# EasyEDA schematic SCH_5Vcc_LM35_with_shortcircuit_protection_2024-01-12.json

## Sheets
1 template_circuit: TITLE: LM32 with 5Vcc and short-circuit protection; REV: 1.0; Date: 2024-01-09; Sheet: 1/1; Drawn By: Mortrack8; Company: Your Company
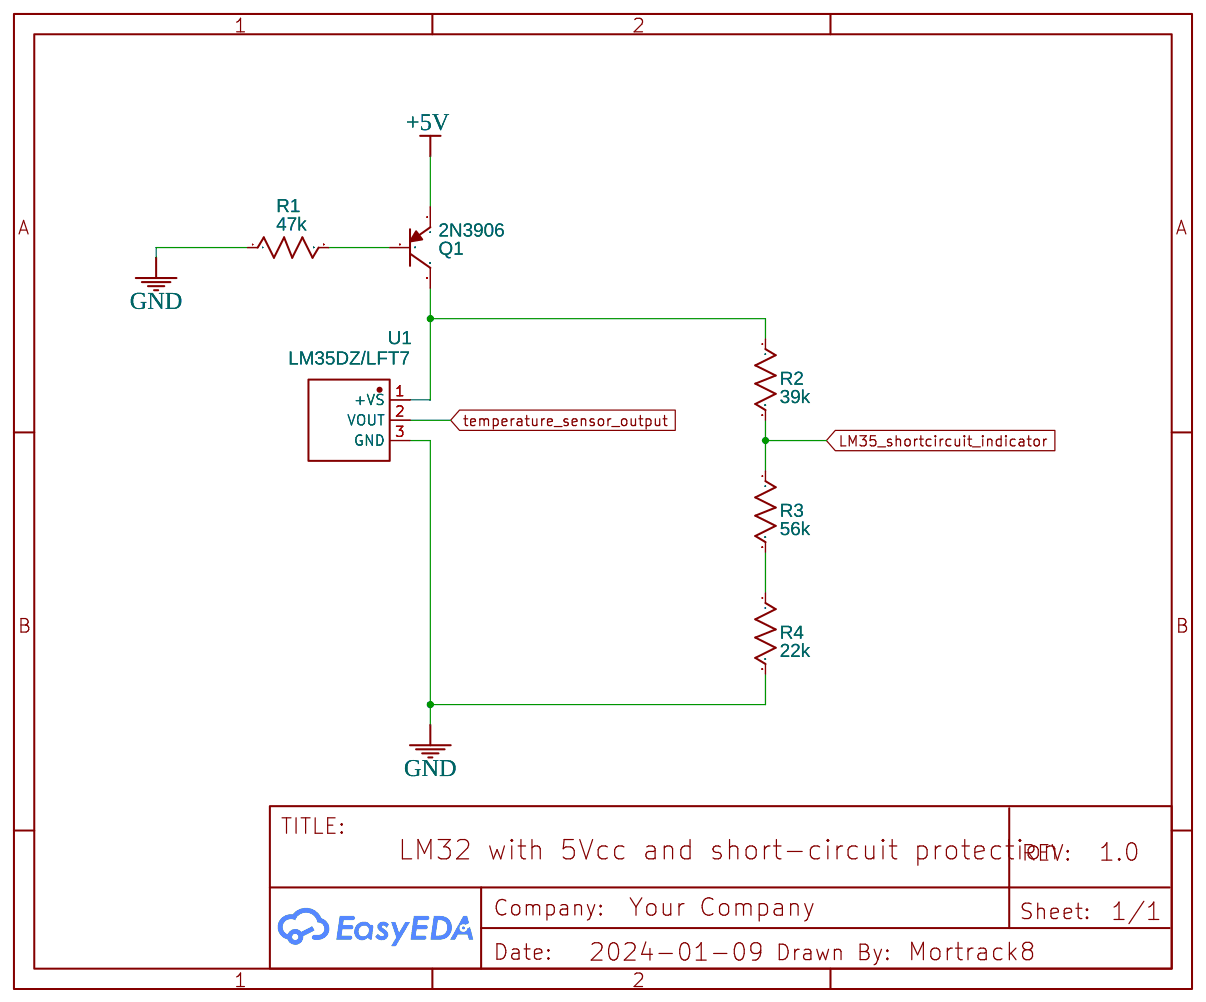
[diagram p0: template_circuit]
2 hot_temperature_sensor_circuit: TITLE: Hot temperature sensor circuit; Company: None
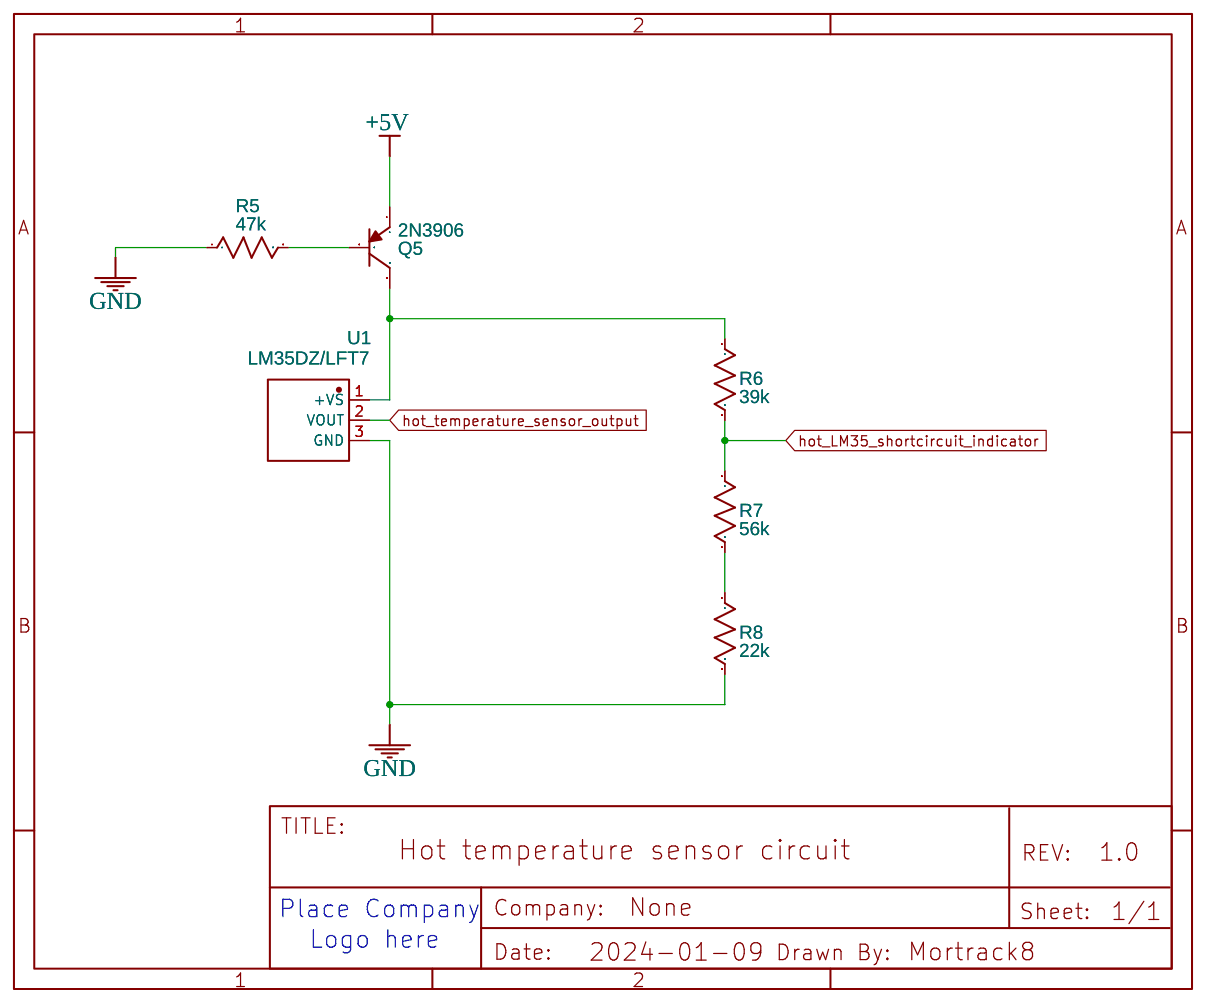
[diagram p1: hot_temperature_sensor_circuit]
3 cold_temperature_sensor_circuit: TITLE: Cold temperature sensor circuit; Company: None
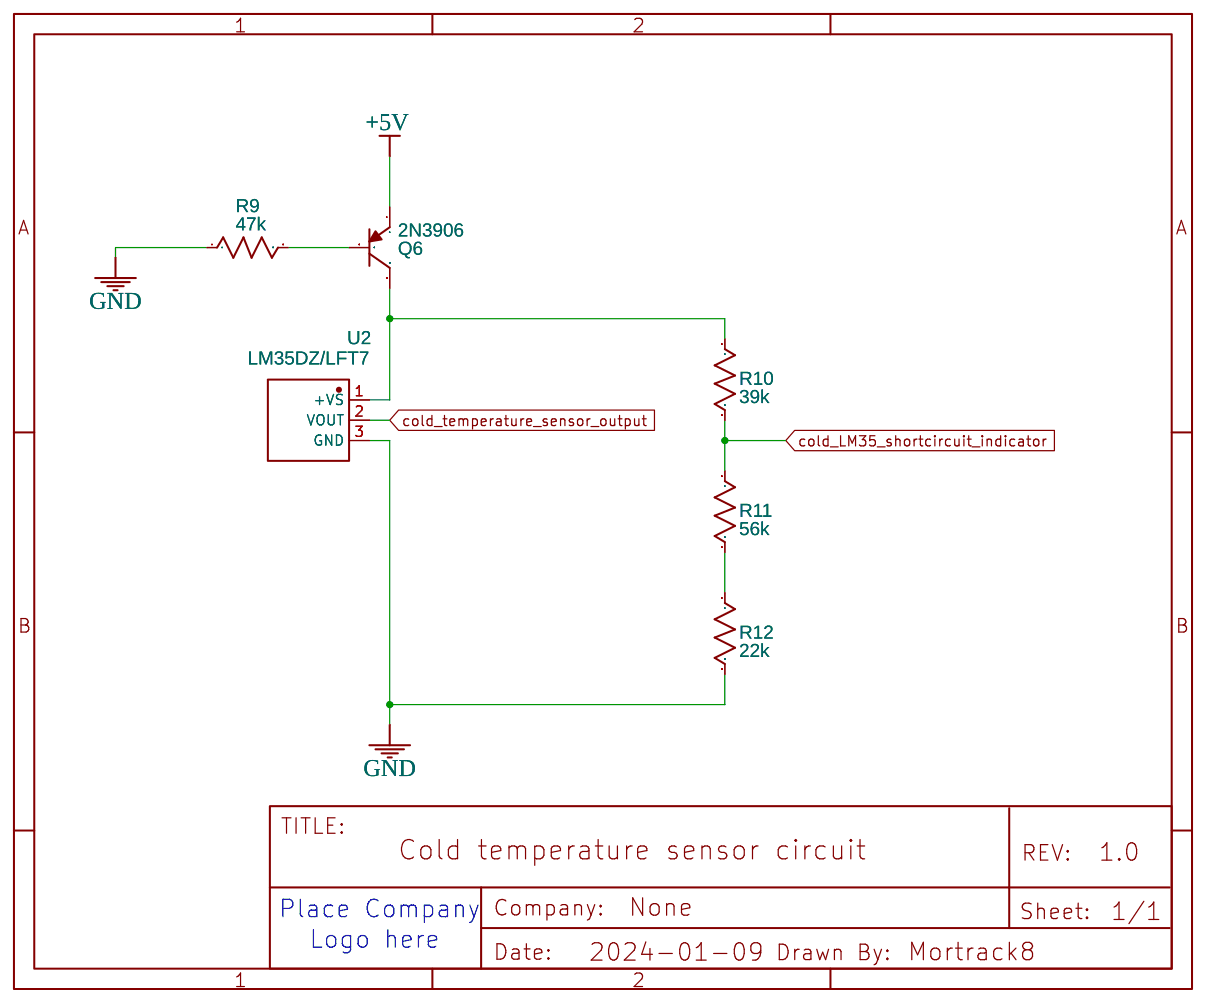
[diagram p2: cold_temperature_sensor_circuit]

## Parts
sheet cold_temperature_sensor_circuit
Q6  2N3906  [TO-92-3_L4.8-W3.7-P2.54-L]
R9  47k  [R_AXIAL-0.5]
R10  39k  [R_AXIAL-0.5]
R11  56k  [R_AXIAL-0.5]
R12  22k  [R_AXIAL-0.5]
U2  LM35DZ/LFT7  [TO-92-3_L4.9-W3.7-P1.27-L]
sheet hot_temperature_sensor_circuit
Q5  2N3906  [TO-92-3_L4.8-W3.7-P2.54-L]
R5  47k  [R_AXIAL-0.5]
R6  39k  [R_AXIAL-0.5]
R7  56k  [R_AXIAL-0.5]
R8  22k  [R_AXIAL-0.5]
U1#2  LM35DZ/LFT7  [TO-92-3_L4.9-W3.7-P1.27-L]
sheet template_circuit
Q1  2N3906  [TO-92-3_L4.8-W3.7-P2.54-L]
R1  47k  [R_AXIAL-0.5]
R2  39k  [R_AXIAL-0.5]
R3  56k  [R_AXIAL-0.5]
R4  22k  [R_AXIAL-0.5]
U1  LM35DZ/LFT7  [TO-92-3_L4.9-W3.7-P1.27-L]

## Library data of the parts
Q1 Q5 Q6 = 2N3906-AP: Contributor: LCSC; Supplier: LCSC; Supplier Part: C2987037; Manufacturer: MCC(美微科); JLCPCB Part Class: Extended Part
R1-R12 = R_AXIAL-0.5_US: Contributor: LCEDA_Lib
U1 U1#2 U2 = LM35DZ/LFT7: Contributor: lcsc; Supplier: LCSC; Supplier Part: C3663110; Manufacturer: TI(德州仪器)

## Nets
+5V: Q1.1 Q5.1 Q6.1
GND: R1.1 R4.2 R5.1 R8.2 R9.1 R12.2 U1.3(GND) U1#2.3(GND) U2.3(GND)
cold_LM35_shortcircuit_indicator: R10.2 R11.1
cold_temperature_sensor_output: U2.2(VOUT)
hot_LM35_shortcircuit_indicator: R6.2 R7.1
hot_temperature_sensor_output: U1#2.2(VOUT)
LM35_shortcircuit_indicator: R2.2 R3.1
temperature_sensor_output: U1.2(VOUT)
Net-(Q1-2): Q1.2 R1.2
Net-(Q1-3): Q1.3 R2.1 U1.1(+VS)
Net-(Q5-2): Q5.2 R5.2
Net-(Q5-3): Q5.3 R6.1 U1#2.1(+VS)
Net-(Q6-2): Q6.2 R9.2
Net-(Q6-3): Q6.3 R10.1 U2.1(+VS)
Net-(R3-2): R3.2 R4.1
Net-(R7-2): R7.2 R8.1
Net-(R11-2): R11.2 R12.1

## Notes on the sheets
sheet 2
- Place Company
- Logo here
sheet 3
- Place Company
- Logo here
